# EAGLE design Wilssen_core_v0.202a (EAGLE 6.3)
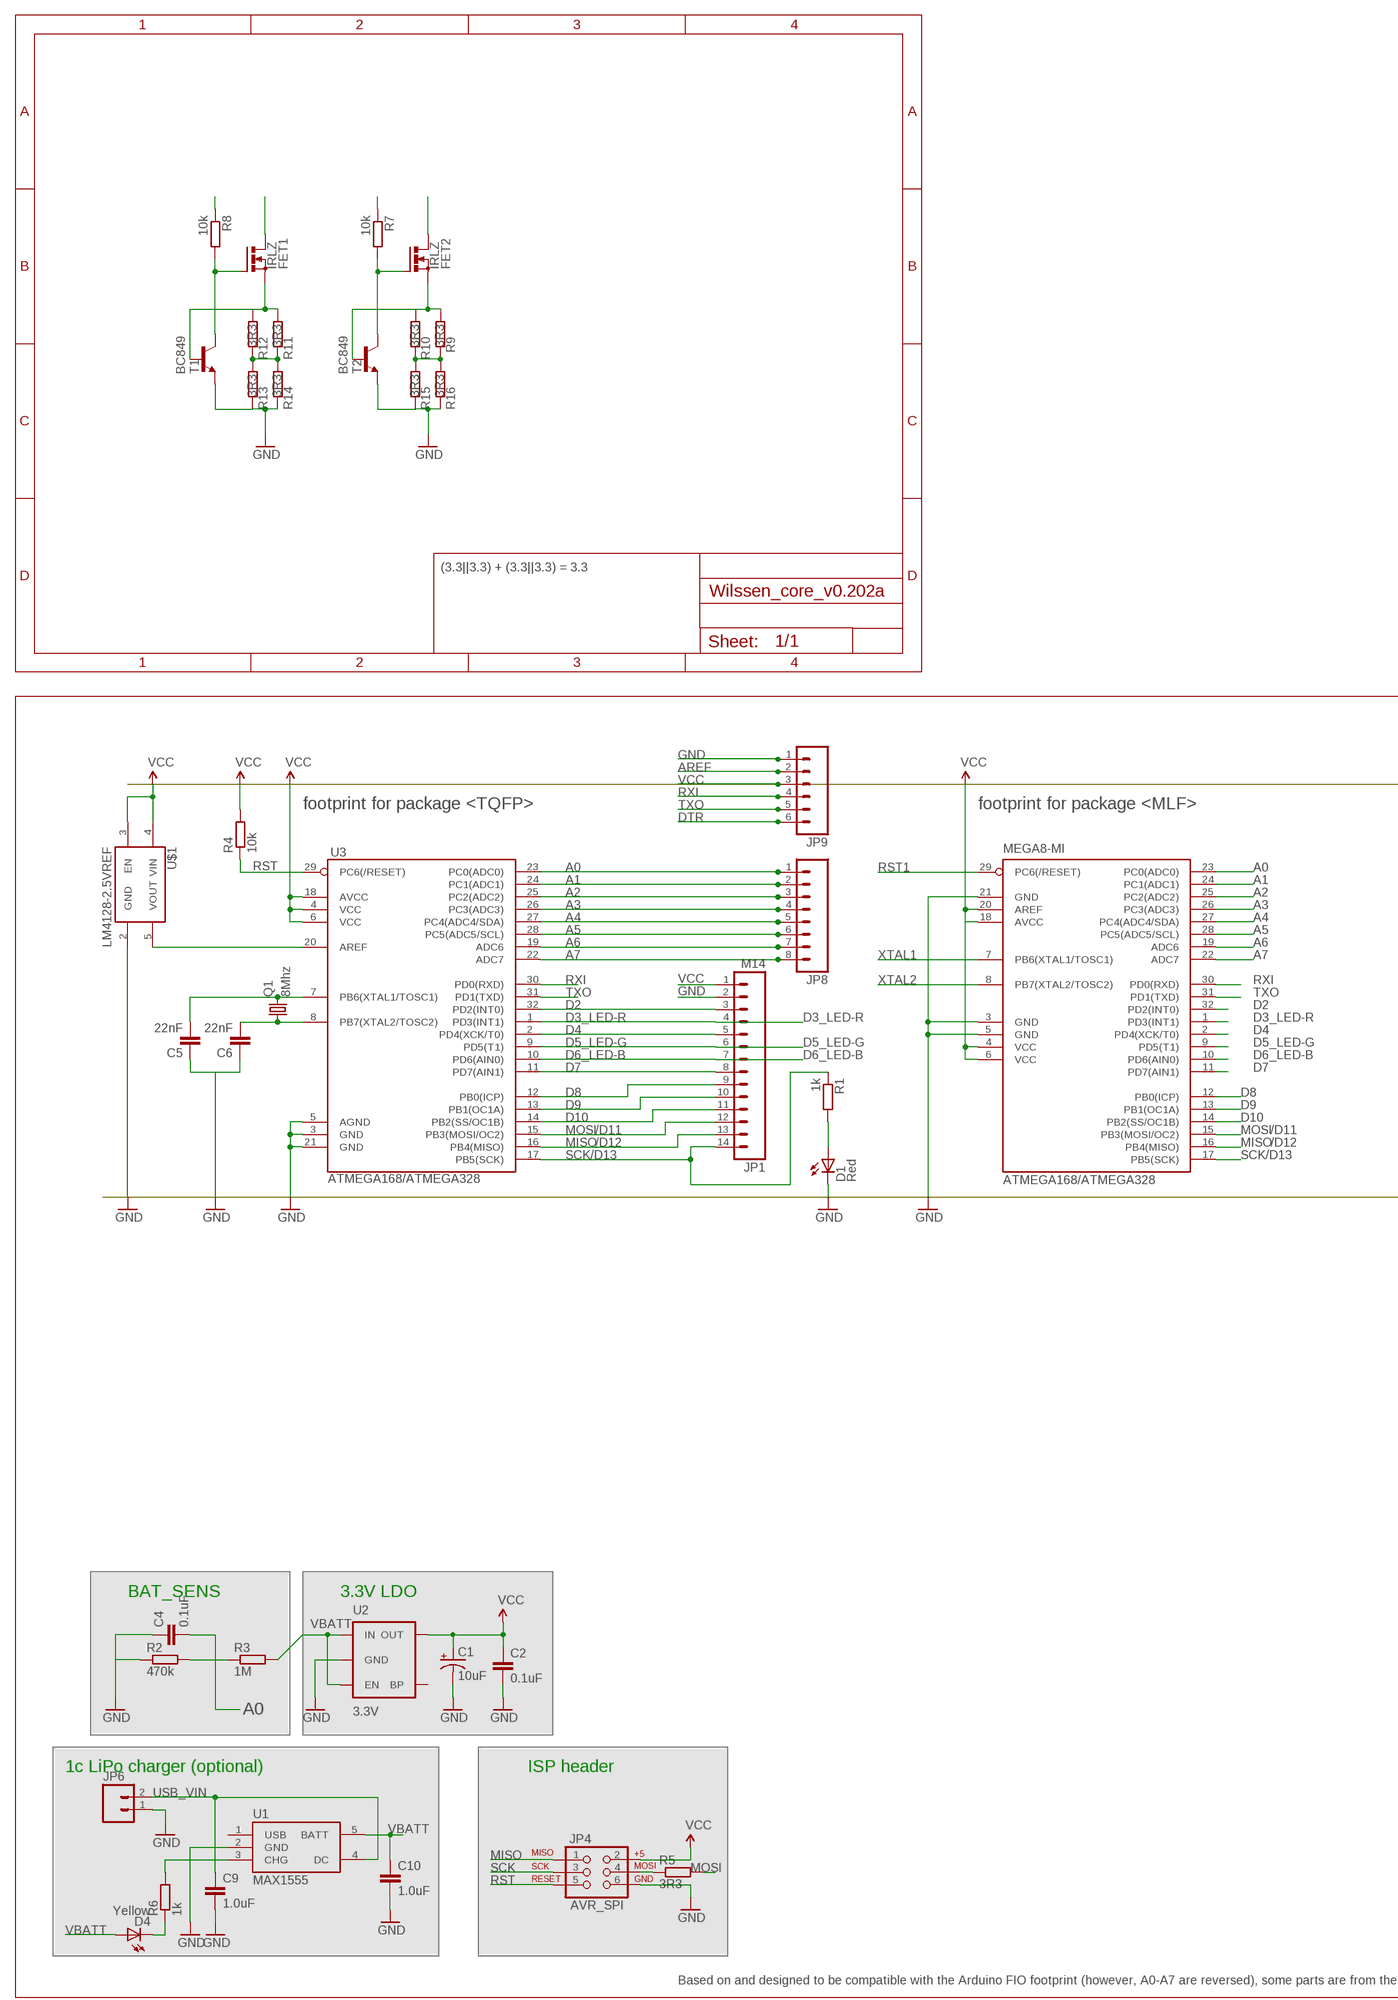
[diagram p0: schematic, sheet 1, part 1 of 2]
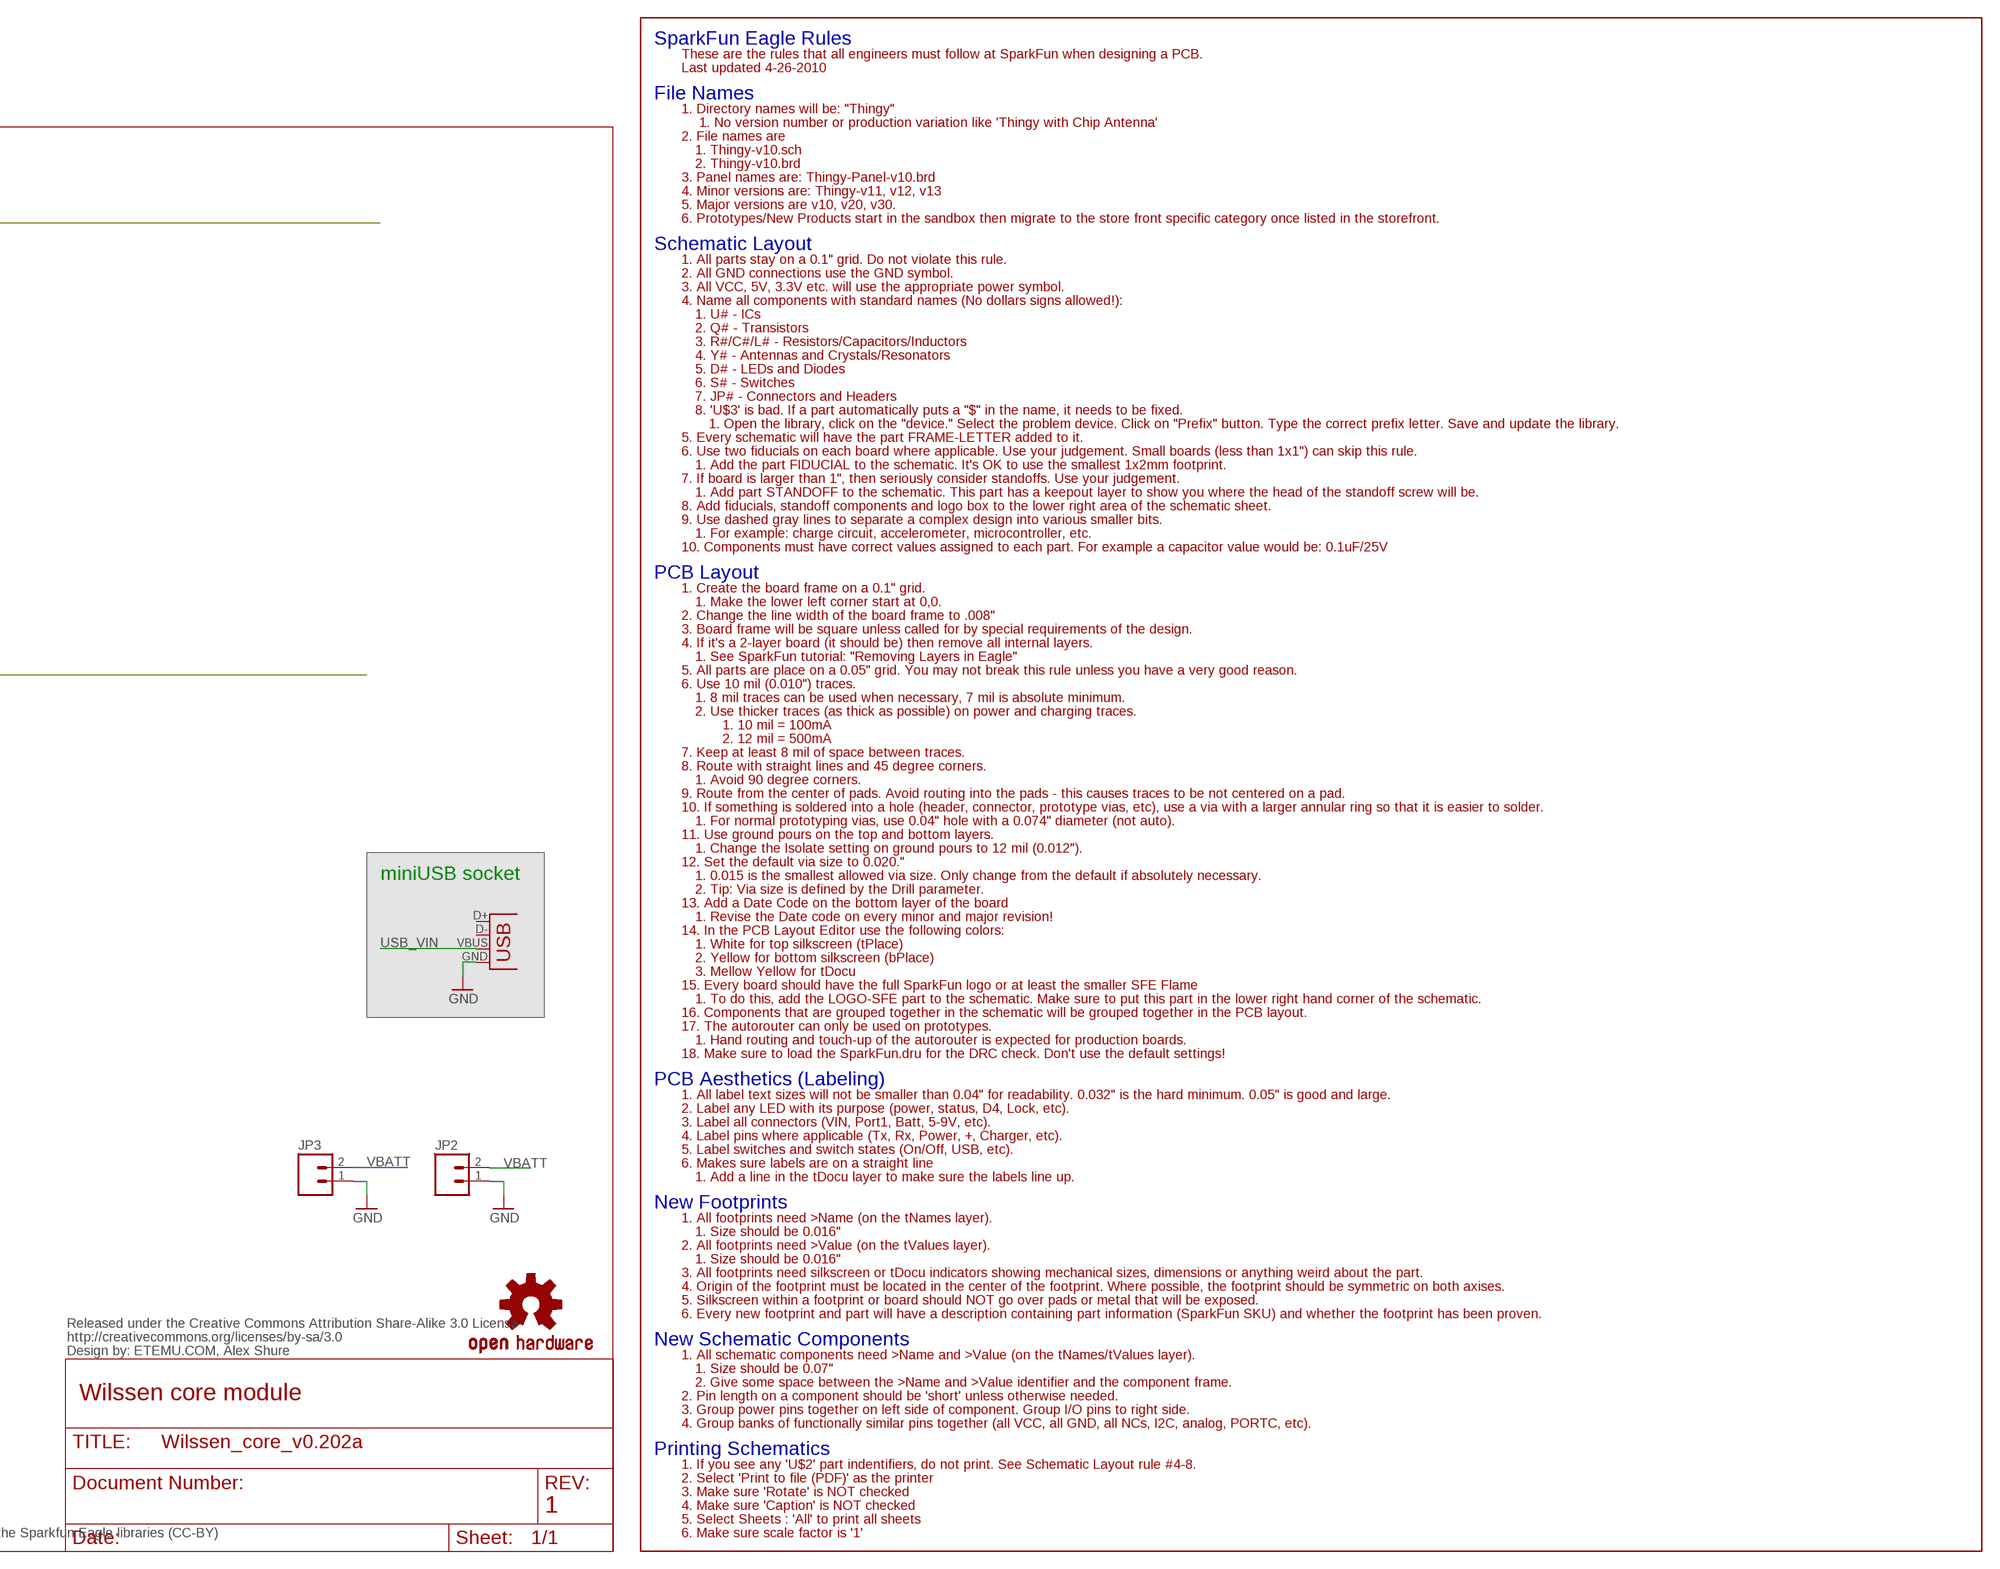
[diagram p1: schematic, sheet 1, part 2 of 2]

## Parts
ATMEGA168/ATMEGA328  MEGA8-MI  [MLF32]
C1  10uF  CAP_POL1206  [EIA3216]
C2  0.1uF  CAP0805  [0805]
C4  0.1uF  CAP0805  [0805]
C5  22nF  CAP0805  [0805]
C6  22nF  CAP0805  [0805]
C9  1.0uF  CAP0805  [0805]
C10  1.0uF  CAP0805  [0805]
CC_TEXT1  CREATIVE_COMMONS  [CREATIVE_COMMONS]
D1  Red  LED0603  [LED-0603]
D4  Yellow  LED0603  [LED-0603]
FET1  IRLZ  PMOSFET_NTO220BV  [TO220BV]
FET2  IRLZ  PMOSFET_NTO220BV  [TO220BV]
JP1  M14  [1X14]
JP2  M02PTH  [1X02]
JP3  M02-JST-2MM-SMT  [S2B-PH]
JP4  AVR_SPI  AVR_SPI_PRG_6PTH  [2X3]
JP6  M02PTH  [1X02]
JP8  M081X08  [1X08]
JP9  M06SIP  [1X06]
LOGO1  OSHW-LOGOS  [OSHW-LOGO-S]
Q1  8Mhz  CRYSTALSM49  [SM49]
R1  1k  R-EU_R0805  [R0805]
R2  470k  R-EU_R0805  [R0805]
R3  1M  R-EU_R0805  [R0805]
R4  10k  R-EU_R0805  [R0805]
R5  3R3  R-EU_R1206  [R1206]
R6  1k  R-EU_R0805  [R0805]
R7  10k  R-EU_R0805  [R0805]
R8  10k  R-EU_R0805  [R0805]
R9  3R3  R-EU_R1206  [R1206]
R10  3R3  R-EU_R1206  [R1206]
R11  3R3  R-EU_R1206  [R1206]
R12  3R3  R-EU_R1206  [R1206]
R13  3R3  R-EU_R1206  [R1206]
R14  3R3  R-EU_R1206  [R1206]
R15  3R3  R-EU_R1206  [R1206]
R16  3R3  R-EU_R1206  [R1206]
T1  BC849  [SOT23]
T2  BC849  [SOT23]
U1  MAX1555  [SOT23-5]
U2  3.3V  V_REG_LDOSMD  [SOT23-5]
U3  ATMEGA168/ATMEGA328  ATMEGA168  [TQFP32-08]
U$1  LM4128-2.5VREF  [SOT23-5]
X1  USBSMD  [USB-MINIB]

## Nets
A0: ATMEGA168/ATMEGA328.23(PC0(ADC0)) C4.2 JP8.1 R2.2 R3.1 U3.23(PC0(ADC0))
A1: ATMEGA168/ATMEGA328.24(PC1(ADC1)) JP8.2 U3.24(PC1(ADC1))
A2: ATMEGA168/ATMEGA328.25(PC2(ADC2)) JP8.3 U3.25(PC2(ADC2))
A3: ATMEGA168/ATMEGA328.26(PC3(ADC3)) JP8.4 U3.26(PC3(ADC3))
A4: ATMEGA168/ATMEGA328.27(PC4(ADC4/SDA)) JP8.5 U3.27(PC4(ADC4/SDA))
A5: ATMEGA168/ATMEGA328.28(PC5(ADC5/SCL)) JP8.6 U3.28(PC5(ADC5/SCL))
A6: ATMEGA168/ATMEGA328.19(ADC6) JP8.7 U3.19(ADC6)
A7: ATMEGA168/ATMEGA328.22(ADC7) JP8.8 U3.22(ADC7)
AREF: JP9.2
D2: ATMEGA168/ATMEGA328.32(PD2(INT0)) JP1.3 U3.32(PD2(INT0))
D3_LED-R: ATMEGA168/ATMEGA328.1(PD3(INT1)) JP1.4 R8.1 U3.1(PD3(INT1))
D4: ATMEGA168/ATMEGA328.2(PD4(XCK/T0)) JP1.5 U3.2(PD4(XCK/T0))
D5_LED-G: ATMEGA168/ATMEGA328.9(PD5(T1)) JP1.6 R7.1 U3.9(PD5(T1))
D6_LED-B: ATMEGA168/ATMEGA328.10(PD6(AIN0)) JP1.7 U3.10(PD6(AIN0))
D7: ATMEGA168/ATMEGA328.11(PD7(AIN1)) JP1.8 U3.11(PD7(AIN1))
D8: ATMEGA168/ATMEGA328.12(PB0(ICP)) JP1.9 U3.12(PB0(ICP))
D9: ATMEGA168/ATMEGA328.13(PB1(OC1A)) JP1.10 U3.13(PB1(OC1A))
D10: ATMEGA168/ATMEGA328.14(PB2(SS/OC1B)) JP1.11 U3.14(PB2(SS/OC1B))
DTR: JP9.6
GATE1: FET1.G R8.2 T1.3(C)
GATE2: FET2.G R7.2 T2.3(C)
GND: ATMEGA168/ATMEGA328.3(GND) ATMEGA168/ATMEGA328.5(GND) ATMEGA168/ATMEGA328.21(GND) C1.C(-) C2.2 C4.1 C5.1 C6.1 C9.2 C10.2 D1.C JP1.2 JP2.1 JP3.1 JP4.6 JP6.1 JP9.1 R2.1 R13.2 R14.2 R15.2 R16.2 T1.2(E) T2.2(E) U1.2(GND) U2.2(GND) U3.3(GND) U3.5(AGND) U3.21(GND) U$1.2(GND) X1.GND
LED-OUT_G: FET2.D
LED-OUT_R: FET1.D
MISO: ATMEGA168/ATMEGA328.16(PB4(MISO)) JP1.13 JP4.1 U3.16(PB4(MISO))
MOSI: ATMEGA168/ATMEGA328.15(PB3(MOSI/OC2)) JP1.12 R5.2 U3.15(PB3(MOSI/OC2))
N$1: JP4.4 R5.1
N$2: D1.A R1.2
N$3: U3.20(AREF) U$1.5(VOUT)
N$8: D4.C R6.1
N$11: R6.2 U1.3(CHG)
NS$1: R11.2 R12.2 R13.1 R14.1
NS$2: R9.2 R10.2 R15.1 R16.1
RST: JP4.5 R4.1 U3.29(PC6(/RESET))
RST1: ATMEGA168/ATMEGA328.29(PC6(/RESET))
RXI: ATMEGA168/ATMEGA328.30(PD0(RXD)) JP9.4 U3.30(PD0(RXD))
SCK: ATMEGA168/ATMEGA328.17(PB5(SCK)) JP1.14 JP4.3 R1.1 U3.17(PB5(SCK))
SRC1: FET1.S R11.1 R12.1 T1.1(B)
SRC2: FET2.S R9.1 R10.1 T2.1(B)
TXO: ATMEGA168/ATMEGA328.31(PD1(TXD)) JP9.5 U3.31(PD1(TXD))
USB_VIN: C9.1 JP6.2 U1.4(DC) X1.VBUS
VBATT: C10.1 D4.A JP2.2 JP3.2 R3.2 U1.5(BATT) U2.1(IN) U2.3(EN)
VCC [VCC]: ATMEGA168/ATMEGA328.4(VCC) ATMEGA168/ATMEGA328.6(VCC) ATMEGA168/ATMEGA328.18(AVCC) ATMEGA168/ATMEGA328.20(AREF) C1.A(+) C2.1 JP1.1 JP4.2 JP9.3 R4.2 U2.5(OUT) U3.4(VCC) U3.6(VCC) U3.18(AVCC) U$1.3(EN) U$1.4(VIN)
XTAL1: ATMEGA168/ATMEGA328.7(PB6(XTAL1/TOSC1)) C5.2 Q1.2 U3.7(PB6(XTAL1/TOSC1))
XTAL2: ATMEGA168/ATMEGA328.8(PB7(XTAL2/TOSC2)) C6.2 Q1.1 U3.8(PB7(XTAL2/TOSC2))
Unconnected: U1.1(USB) U2.4(BP) X1.D+ X1.D-

## Notes on the sheet
- (3.3||3.3) + (3.3||3.3) = 3.3
- footprint for package <TQFP> | footprint for package <MLF>
- /D11 | /D11
- /D12 | /D12
- /D13 | /D13
- miniUSB socket
- BAT_SENS | 3.3V LDO
- 1c LiPo charger (optional) | ISP header
- ETEMU.COM, Alex Shure
- Wilssen core module
- 1
- Based on and designed to be compatible with the Arduino FIO footprint (however, A0-A7 are reversed), some parts are from the Sparkfun Eagle libraries (CC-BY)

## Library data of the parts
ATMEGA168/ATMEGA328 = atmel:MEGA8: MICROCONTROLLER 8 Kbytes FLASH, 1 kbytes SRAM, 512 bytes EEPROM, USART, 6-channel 10 bit ADC, 2-channel 8 bit ADC Pin compatible with Atmega48, ATMega88, ATMega168 Source: avr.lbr; MPN: ATMEGA88PA-MU; OC_FARNELL: 1715491; OC_NEWARK: 15R0272
C1 = SparkFun:CAP_POL: Capacitor Polarized These are standard SMD and PTH capacitors. Normally 10uF, 47uF, and 100uF in electrolytic and tantalum varieties. Always verify the external diameter of the through hole cap, it varies with capacity, voltage, and manufacturer. The EIA devices should be standard.
C2 C4-C6 C9 C10 = SparkFun:CAP: Capacitor Standard 0603 ceramic capacitor, and 0.1" leaded capacitor.
CC_TEXT1 = SparkFun-Aesthetics:CREATIVE_COMMONS: Creative Commons License summary
D1 D4 = SparkFun:LED: LEDs Standard schematic elements and footprints for 5mm, 3mm, 1206, and 0603 sized LEDs. 5mm - Spark Fun Electronics SKU : COM-00529 (and others)
FET1 FET2 = transistor-power:PMOSFET_N: Power MOSFET N-Channel
JP1 = SparkFun:M14: Header 14 Standard 14-pin 0.1" header. Use with straight break away headers (SKU : PRT-00116), right angle break away headers (PRT-00553), swiss pins (PRT-00743), machine pins (PRT-00117), and female headers (PRT-00115).
JP2 JP3 JP6 = SparkFun:M02: Header 2 Standard 2-pin 0.1" header. Use with straight break away headers (SKU : PRT-00116), right angle break away headers (PRT-00553), swiss pins (PRT-00743), machine pins (PRT-00117), and female headers (PRT-00115). Molex polarized connector foot print use with SKU : PRT-08233 with associated crimp pins and housings.
JP4 = SparkFun:AVR_SPI_PRG_6: AVR ISP 6 Pin This is the reduced ISP connector for AVR programming. Common on Arduino. This footprint will take up less PCB space and can be used with a 10-pin to 6-pin adapter such as SKU: BOB-08508
JP8 = SparkFun-Connectors:M08: Header 8 Standard 8-pin 0.1" header. Use with straight break away headers (SKU : PRT-00116), right angle break away headers (PRT-00553), swiss pins (PRT-00743), machine pins (PRT-00117), and female headers (PRT-00115).
JP9 = SparkFun-Connectors:M06: Header 6 Standard 6-pin 0.1" header. Use with straight break away headers (SKU : PRT-00116), right angle break away headers (PRT-00553), swiss pins (PRT-00743), machine pins (PRT-00117), and female headers (PRT-00115). Molex polarized connector foot print use with SKU : PRT-08094 with associated crimp pins and housings. NOTES ON THE VARIANTS LOCK and LOCK_LONGPADS... This footprint was designed to help hold the alignment of a through-hole component (i.e. 6-pin header) while soldering it into place. You may notice that each hole has been shifted either up or down by 0.005 of an inch from it's more standard position (which is a perfectly straight line). This slight alteration caused the pins (the squares in the middle) to touch the edges of the holes. Because they are alternating, it causes a "brace" to hold the component in place. 0.005 has proven to be the perfect amount of "off-center" position when using our standard breakaway headers. Although looks a little odd when you look at the bare footprint, once you have a header in there, the alteration is very hard to notice. Also, if you push a header all the way into place, it is covered up entirely on the bottom side. This idea of altering the position of holes to aid alignment will be further integrated into the Sparkfun Library for other footprints. It can help hold any component with 3 or more connection pins.
LOGO1 = SparkFun-Aesthetics:OSHW-LOGO: Open Source Hardware Logo This logo indicates the piece of hardware it is found on incorporates a OSHW license and/or adheres to the definition of open source hardware found here: http://freedomdefined.org/OSHW
Q1 = crystal:CRYSTAL: CRYSTAL; OC_FARNELL: unknown; OC_NEWARK: unknown
R1-R6 = rcl:R-EU_: RESISTOR, European symbol
R7-R16 = resistor:R-EU_: RESISTOR, European symbol
T1 T2 = transistor:BC849: NPN TRANSISTOR
U1 = SparkFun:MAX1555: MAX1555 Lithium Charger IC SOT-23 Lithium Polymer charging IC. Schematic element and footprint proven. Spark Fun Electronics SKU : COM-00674
U2 = SparkFun:V_REG_LDO: Voltage Regulator LDO Standard 150mA LDO voltage regulator in SOT-23 layout. Micrel part MIC5205. BP (by-pass) pin is used to lower output noise with 470pF cap.
U3 = SparkFun:ATMEGA168
U$1 = SparkFun-PowerIC:LM4128-2.5VREF: .1% accurate low-current voltage reference
X1 = SparkFun:USB: USB Connectors USB-B-PTH is fully proven SKU : PRT-00139 USB-miniB is fully proven SKU : PRT-00587 USB-A-PCB is untested. USB-A-H is throughly reviewed, but untested. Spark Fun Electronics SKU : PRT-00437 USB-B-SMT is throughly reviewed, but untested. Needs silkscreen touching up. USB-A-S has not been used/tested USB-MB-H has not been used/tested

## Net classes
0 Default: width 0.203 mm
1 VCC: width 0.381 mm
2 LEDPower: width 0.203 mm
3 ButtonSignal: width 0.203 mm

## Board
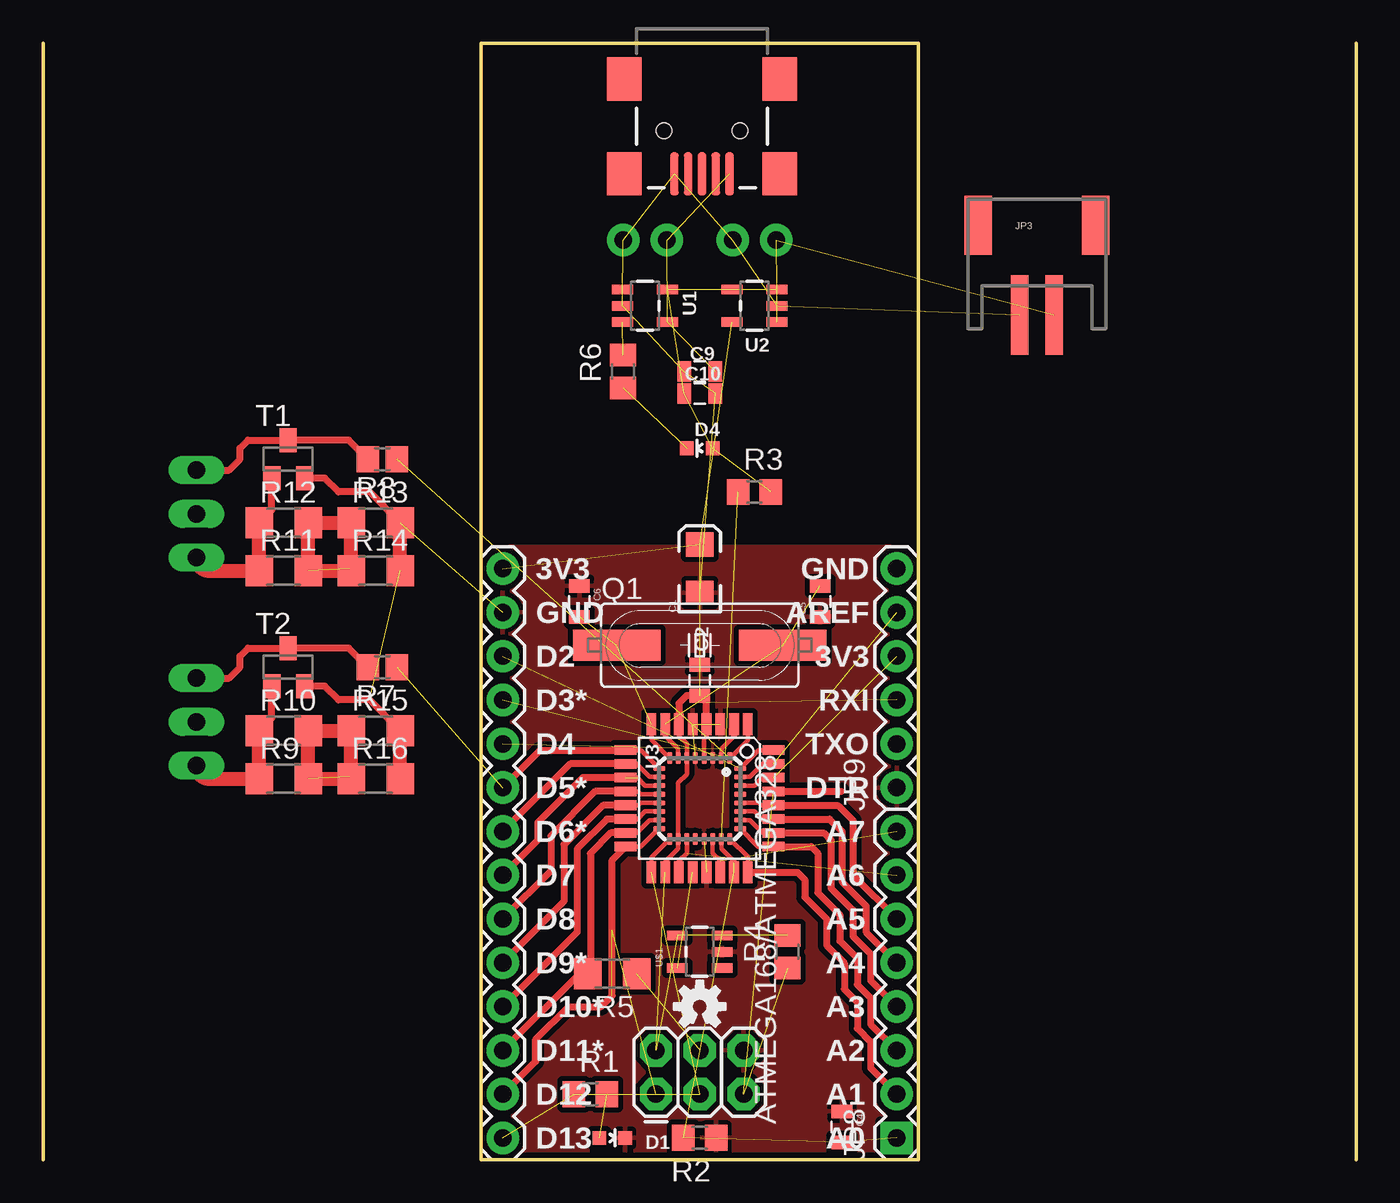
[diagram p2: board, top side]
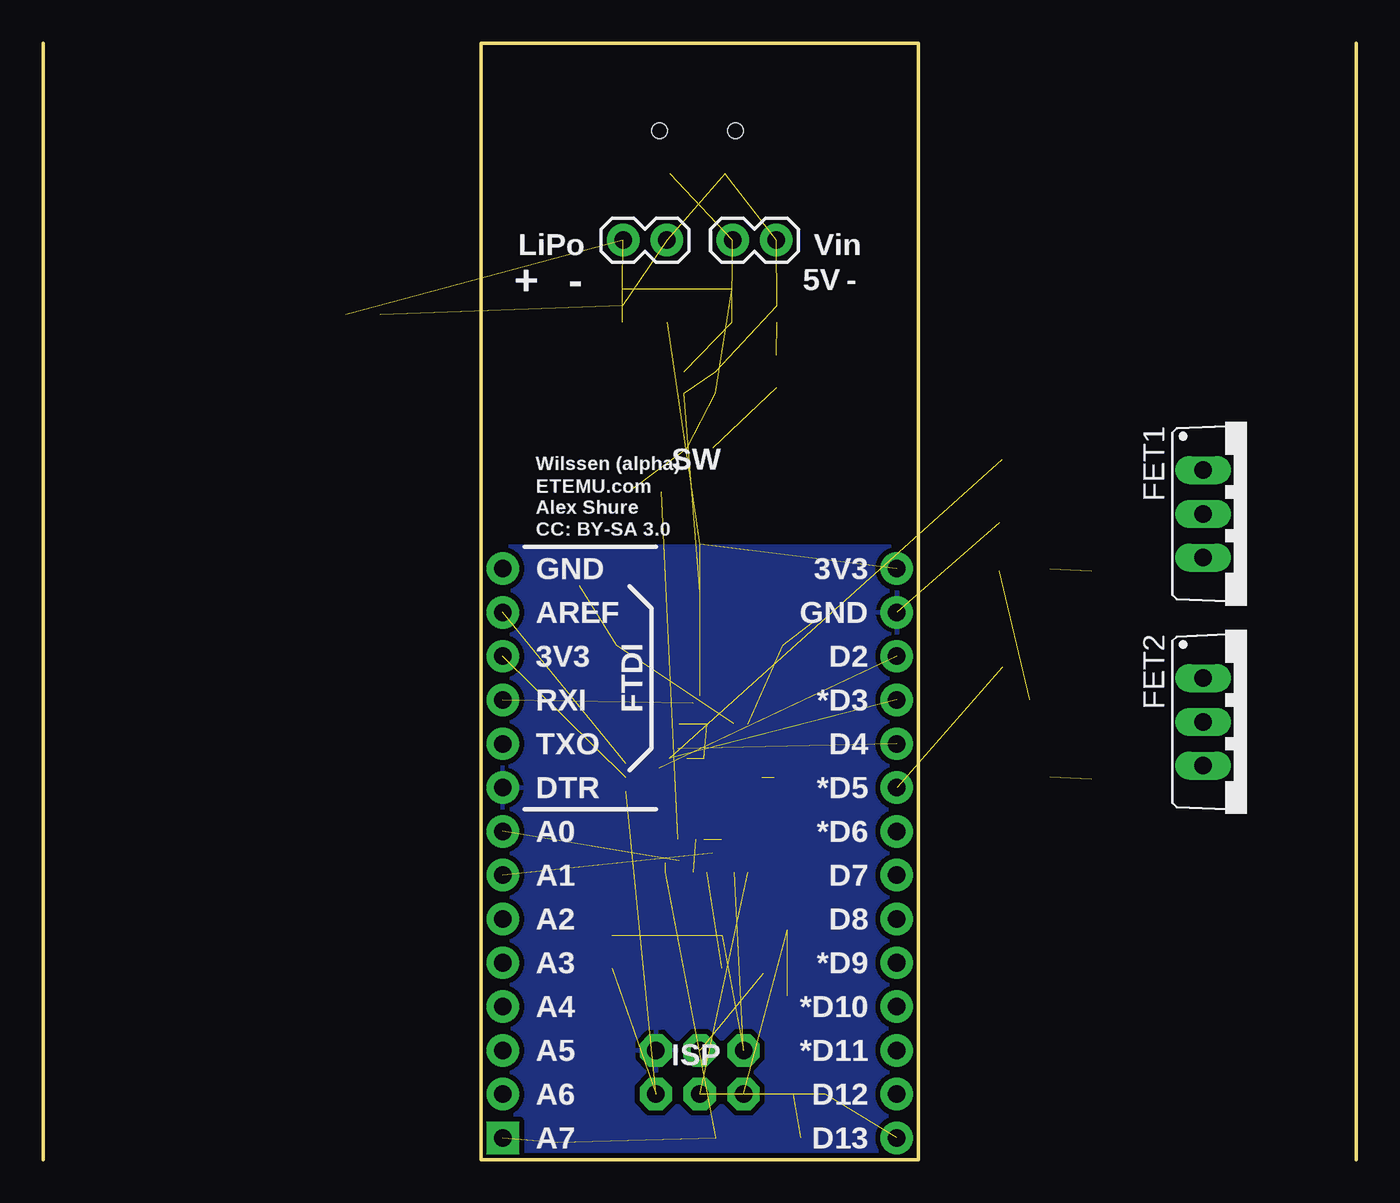
[diagram p3: board, bottom side, seen from below]

Size 76.2 x 64.77 mm. Coordinates in mm from the lower left corner, seen from the top.
Outline: 0,0 0,64.77
Outline: 76.2,64.77 76.2,0
Outline: 50.8,64.77 50.8,0 25.4,0 25.4,64.77 50.8,64.77
Copper layers (1*16): Top 0.035mm / dielectric 1.5mm / Bottom 0.035mm
Design rules "SparkFun *": minimum track width 8mil, minimum drill 20mil, track to track 8mil, track to pad 8mil, pad to pad 8mil, via to via 8mil, smd to smd 8mil, copper to edge 10mil, drill to drill 8mil, minimum pad ring 12mil, minimum via ring 10mil, stop-mask expansion 4mil, vias tented up to drill 25mil, thermal gap 10mil

### Footprints (pad centres in the part's own frame; a part is rotated, then mirrored left to right if it is on the bottom)
MLF32 = smd 0.7 x 0.3: 1 -2.35,1.75; 2 -2.35,1.25; 3 -2.35,0.75; 4 -2.35,0.25; 5 -2.35,-0.25; 6 -2.35,-0.75; 7 -2.35,-1.25; 8 -2.35,-1.75; 17 2.35,-1.75; 18 2.35,-1.25; 19 2.35,-0.75; 20 2.35,-0.25; 21 2.35,0.25; 22 2.35,0.75; 23 2.35,1.25; 24 2.35,1.75 | smd 0.3 x 0.7: 9 -1.75,-2.35; 10 -1.25,-2.35; 11 -0.75,-2.35; 12 -0.25,-2.35; 13 0.25,-2.35; 14 0.75,-2.35; 15 1.25,-2.35; 16 1.75,-2.35; 25 1.75,2.35; 26 1.25,2.35; 27 0.75,2.35; 28 0.25,2.35; 29 -0.25,2.35; 30 -0.75,2.35; 31 -1.25,2.35; 32 -1.75,2.35
EIA3216 = smd 1.4 x 1.6: A 1.4,0; C -1.4,0
0805 = smd 0.8 x 1.2: 1 -0.9,0; 2 0.9,0
LED-0603 = smd 0.8 x 0.8: A 0,-0.75; C 0,0.75
TO220BV = drill 1.016 long: D 0,-2.54; G -2.54,-2.54; S 2.54,-2.54
1X14 = drill 1.016 pad 1.88: 1 0,0; 2 2.54,0; 3 5.08,0; 4 7.62,0; 5 10.16,0; 6 12.7,0; 7 15.24,0; 8 17.78,0; 9 20.32,0; 10 22.86,0; 11 25.4,0; 12 27.94,0; 13 30.48,0; 14 33.02,0
1X02 = drill 1.016 pad 1.88: 1 0,0; 2 2.54,0
S2B-PH = smd 1 x 4.6: 1 -1,-3.7; 2 1,-3.7 | smd 1.6 x 3.4: NC1 -3.4,1.5; NC2 3.4,1.5
2X3 = drill 1.016 pad 1.88 octagon: 1 0,0; 2 0,2.54; 3 2.54,0; 4 2.54,2.54; 5 5.08,0; 6 5.08,2.54
1X08 = drill 1.016 pad 1.88 square: 1 0,0 | drill 1.016 pad 1.88: 2 2.54,0; 3 5.08,0; 4 7.62,0; 5 10.16,0; 6 12.7,0; 7 15.24,0; 8 17.78,0
1X06 = drill 1.016 pad 1.88: 1 0,0; 2 2.54,0; 3 5.08,0; 4 7.62,0; 5 10.16,0; 6 12.7,0
SM49 = smd 5.08 x 1.778: 1 -4.826,0; 2 4.826,0
R0805 = smd 1.3 x 1.5: 1 -0.95,0; 2 0.95,0
R1206 = smd 1.6 x 1.803: 1 -1.422,0; 2 1.422,0
R0805' = smd 1.3 x 1.5: 1 -0.85,0; 2 0.85,0
SOT23 = smd 1 x 1.4: 1 -0.95,-1.1; 2 0.95,-1.1; 3 0,1.1
SOT23-5 = smd 0.55 x 1.2: 1 -0.95,-1.3; 2 0,-1.3; 3 0.95,-1.3; 4 0.95,1.3; 5 -0.95,1.3
TQFP32-08 = smd 1.27 x 0.559: 1 -4.293,2.8; 2 -4.293,2; 3 -4.293,1.2; 4 -4.293,0.4; 5 -4.293,-0.4; 6 -4.293,-1.2; 7 -4.293,-2; 8 -4.293,-2.8; 17 4.293,-2.8; 18 4.293,-2; 19 4.293,-1.2; 20 4.293,-0.4; 21 4.293,0.4; 22 4.293,1.2; 23 4.293,2; 24 4.293,2.8 | smd 0.559 x 1.27: 9 -2.8,-4.293; 10 -2,-4.293; 11 -1.2,-4.293; 12 -0.4,-4.293; 13 0.4,-4.293; 14 1.2,-4.293; 15 2,-4.293; 16 2.8,-4.293; 25 2.8,4.293; 26 2,4.293; 27 1.2,4.293; 28 0.4,4.293; 29 -0.4,4.293; 30 -1.2,4.293; 31 -2,4.293; 32 -2.8,4.293
USB-MINIB = smd 2.5 x 0.508: D+ 2.5,0; D- 2.5,0.8; GND 2.5,-1.6; ID 2.5,-0.8; VBUS 2.5,1.6 | smd 2.5 x 2: GND@1 -3,-4.5; GND@2 -3,4.5; GND@3 2.5,4.5; GND@4 2.5,-4.5 | hole 0.9: 0,2.2; 0,-2.2

### Placement (x,y rotation side)
ATMEGA168/ATMEGA328  38.1,20.95 270 top
C1  38.1,34.29 90 top
C2  38.1,27.81 90 top
C4  46.36,1.91 270 top
C5  45.09,32.38 90 top
C6  31.12,32.38 270 top
C9  38.1,45.72 180 top
C10  38.1,44.45 0 top
CC_TEXT1  38.73,-13.34 0 top  (outside the outline)
D1  33.02,1.27 270 top
D4  38.1,41.27 90 top
FET1  6.35,37.47 270 bottom
FET2  6.35,25.4 270 bottom
JP1  26.67,34.29 270 top
JP2  40.01,53.34 180 bottom
JP3  57.66,52.7 0 top
JP4  35.56,3.81 0 top
JP6  33.66,53.34 180 bottom
JP8  49.53,1.27 90 top
JP9  49.53,21.59 90 top
LOGO1  38.1,8.89 0 top
Q1  38.1,29.84 0 top
R1  31.75,3.81 0 top
R2  38.1,1.27 180 top
R3  41.27,38.73 0 top
R4  43.18,12.06 90 top
R5  33.02,10.79 180 top
R6  33.66,45.72 90 top
R7  10k  [R0805']  19.69,28.57 180 top
R8  10k  [R0805']  19.69,40.64 180 top
R9  13.97,22.1 0 top
R10  13.97,24.89 0 top
R11  13.97,34.16 0 top
R12  13.97,36.96 0 top
R13  19.3,36.96 0 top
R14  19.3,34.16 0 top
R15  19.3,24.89 0 top
R16  19.3,22.1 0 top
T1  14.22,40.64 0 top
T2  14.22,28.57 0 top
U1  34.93,49.53 270 top
U2  41.27,49.53 90 top
U3  38.09,20.96 270 top
U$1  38.1,12.06 90 top
X1  38.23,59.69 270 top

### Tracks (layer width: path | path; a pad name or v marks a point on that pad's centre or on a via)
A0  (5 unrouted)
  Top 0.254: ATMEGA168/ATMEGA328.23 39.35,18.05 40.13,17.27 40.09,17.23
A1
  Top 0.254: ATMEGA168/ATMEGA328.24 40.89,17.57 U3.24
  Top 0.406: U3.24 43.78,16.67 44.2,16.26 44.2,15.24 45.47,13.97 45.47,12.45 46.48,11.43 46.48,9.91 47.24,9.14 47.24,7.62 48.01,6.86 48.01,5.33 JP8.2
A2
  Top 0.254: ATMEGA168/ATMEGA328.25 41.49,18.16 U3.25
  Top 0.406: JP8.3 48.01,7.87 48.01,9.4 47.24,10.16 47.24,11.68 46.23,12.7 46.23,14.22 44.96,15.49 44.96,17.78 44.57,18.16 U3.25
A3
  Top 0.254: ATMEGA168/ATMEGA328.26 41,19.7 41.74,18.96 U3.26
  Top 0.406: U3.26 45.3,18.96 45.72,18.54 45.72,15.75 46.99,14.48 46.99,12.95 48.01,11.94 48.01,10.41 JP8.4
A4
  Top 0.254: ATMEGA168/ATMEGA328.27 41.26,20.2 41.7,19.77 U3.27
  Top 0.406: U3.27 45.64,19.77 46.36,19.05 46.36,16.13 47.75,14.73 47.75,13.21 JP8.5
A5
  Top 0.254: ATMEGA168/ATMEGA328.28 41.52,20.7 41.66,20.57 U3.28
  Top 0.406: U3.28 46.11,20.57 46.99,19.68 46.99,16.51 JP8.6
A6  (1 unrouted)
  Top 0.254: ATMEGA168/ATMEGA328.19 37.35,17.79 36.89,17.33 U3.19
A7  (1 unrouted)
  Top 0.254: ATMEGA168/ATMEGA328.22 38.85,17.79 39.29,17.35 U3.22
D2  (1 unrouted)
  Top 0.254: ATMEGA168/ATMEGA328.32 41.51,23.77 U3.32
D3_LED-R  (2 unrouted)
  Top 0.254: ATMEGA168/ATMEGA328.1 40.89,24.34 U3.1
D4  (1 unrouted)
  Top 0.254: ATMEGA168/ATMEGA328.2 39.35,23.86 40.13,24.64 40.09,24.68 U3.2
D5_LED-G  (1 unrouted)
  Top 0.254: ATMEGA168/ATMEGA328.9 34.69,23.77 U3.9
  Top 0.406: U3.9 28.84,23.77 JP1.6
D6_LED-B
  Top 0.254: ATMEGA168/ATMEGA328.10 35.2,22.2 34.44,22.96 U3.10
  Top 0.406: U3.10 30.59,22.96 JP1.7
D7  (1 unrouted)
  Top 0.254: ATMEGA168/ATMEGA328.11 34.94,21.7 34.48,22.16
  Top 0.406: U3.11 31.31,22.16 28.7,19.56 28.7,18.54 JP1.8
D8
  Top 0.254: U3.12 33.83,21.34 34.54,21.34 34.68,21.2 ATMEGA168/ATMEGA328.12
  Top 0.406: U3.12 32.03,21.36 29.46,18.8 29.46,16.76 JP1.9
D9
  Top 0.254: U3.13 34.54,20.57 34.68,20.7 ATMEGA168/ATMEGA328.13
  Top 0.406: U3.13 32.5,20.57 30.23,18.29 30.23,14.99 JP1.10
D10
  Top 0.254: U3.14 34.5,19.77 34.94,20.2 ATMEGA168/ATMEGA328.14
  Top 0.406: U3.14 32.72,19.77 30.99,18.03 30.99,13.21 JP1.11
GATE1
  Top 0.406: R8.2 17.73,41.74 T1.3 11.9,41.74 11.43,41.27 11.43,40.64 10.79,40.01 FET1.G
GATE2
  Top 0.406: R7.2 17.73,29.68 T2.3 11.9,29.68 11.43,29.21 11.43,28.57 10.79,27.94 FET2.G
GND  (14 unrouted)
  Top 0.406: R13.2 18.95,38.73 17.15,38.73 16.34,39.54 T1.2 | R15.2 18.95,26.67 17.15,26.67 16.34,27.48 T2.2
  Top 0.813: R14.2 R13.2 | R16.2 R15.2
  pour Top (isolate 0.305): 25.4,35.56 50.8,35.56 50.8,0 25.4,0
  pour Bottom (isolate 0.305): 25.4,35.56 50.8,35.56 50.8,0 25.4,0
MISO  (2 unrouted)
  Top 0.254: ATMEGA168/ATMEGA328.16 35.72,19.2 34.68,18.16 U3.16
  Top 0.406: JP1.13 28.58,5.71 28.58,6.99 30.48,8.89 32.39,8.89 33.02,9.53 33.02,17.39 U3.16
MOSI
  Top 0.254: U3.15 34.46,18.96 35.2,19.7 ATMEGA168/ATMEGA328.15
  Top 0.406: JP1.12 31.12,10.79 R5.2 31.75,10.95 31.75,17.78 32.94,18.96 U3.15
N$1  (1 unrouted)
N$2  (1 unrouted)
N$3  (1 unrouted)
N$8  (1 unrouted)
N$11  (1 unrouted)
NS$1  (1 unrouted)
  Top 0.813: R14.1 R13.1 R12.2 R11.2 17.65,34.16 arc90 17.78,34.29
NS$2  (1 unrouted)
  Top 0.813: R16.1 R15.1 R10.2 R9.2 17.65,22.1 arc90 17.78,22.23
RST  (2 unrouted)
  Top 0.406: U3.29 46.31,21.36
RXI  (1 unrouted)
  Top 0.254: ATMEGA168/ATMEGA328.30 41.26,21.7 41.72,22.16 U3.30
SCK  (3 unrouted)
  Top 0.254: ATMEGA168/ATMEGA328.17 35.29,17.55 U3.17
SRC1
  Top 0.406: R12.1 13.27,37.68 T1.1
  Top 0.813: R12.1 R11.1 9.65,34.16 arc-90 FET1.S
SRC2
  Top 0.406: R10.1 13.27,25.62 T2.1
  Top 0.813: R10.1 R9.1 9.65,22.1 arc-90 FET2.S
TXO  (1 unrouted)
  Top 0.254: ATMEGA168/ATMEGA328.31 41,22.2 41.76,22.96 U3.31
USB_VIN  (3 unrouted)
VBATT  (7 unrouted)
VCC  (9 unrouted)
  Top 0.254: U3.6 36.89,24.58 37.35,24.12 ATMEGA168/ATMEGA328.6 37.35,22.36 36.85,21.86 ATMEGA168/ATMEGA328.18 36.85,18.05 36.09,17.29 U3.18 | ATMEGA168/ATMEGA328.4 38.35,24.38 38.49,24.52 U3.4
  Top 0.406: U3.4 38.49,26.52 C2.1 37.35,26.91 37.34,26.92 36.89,26.48 U3.6
XTAL1  (2 unrouted)
  Top 0.254: ATMEGA168/ATMEGA328.7 36.85,23.86 36.07,24.64 36.09,24.66 U3.7
  Top 0.406: U3.7 36.12,25.29
XTAL2  (2 unrouted)
  Top 0.254: ATMEGA168/ATMEGA328.8 35.29,24.36 U3.8

### Text on the board
tPlace: GND | 3V3 | AREF | GND | 3V3 | D2 | RXI | D3* | TXO | D4 | DTR | D5* | D6* | A7 | D7 | A6 | D8 | A5 | D9* | A4 | D10* | A3 | D11* | A2 | D12 | A1 | D13 | A0
bPlace: Vin | LiPo | - | 5V | - | + | SW | Wilssen (alpha) | ETEMU.com / Alex Shure | CC: BY-SA 3.0 | 3V3 | GND | GND | AREF | D2 | FTDI | 3V3 | *D3 | RXI | D4 | TXO | *D5 | DTR | *D6 | A0 | D7 | A1 | D8 | A2 | *D9 | A3 | *D10 | A4 | *D11 | A5 | ISP | D12 | A6 | D13 | A7